# Altium project PCB_Project.PrjPcb
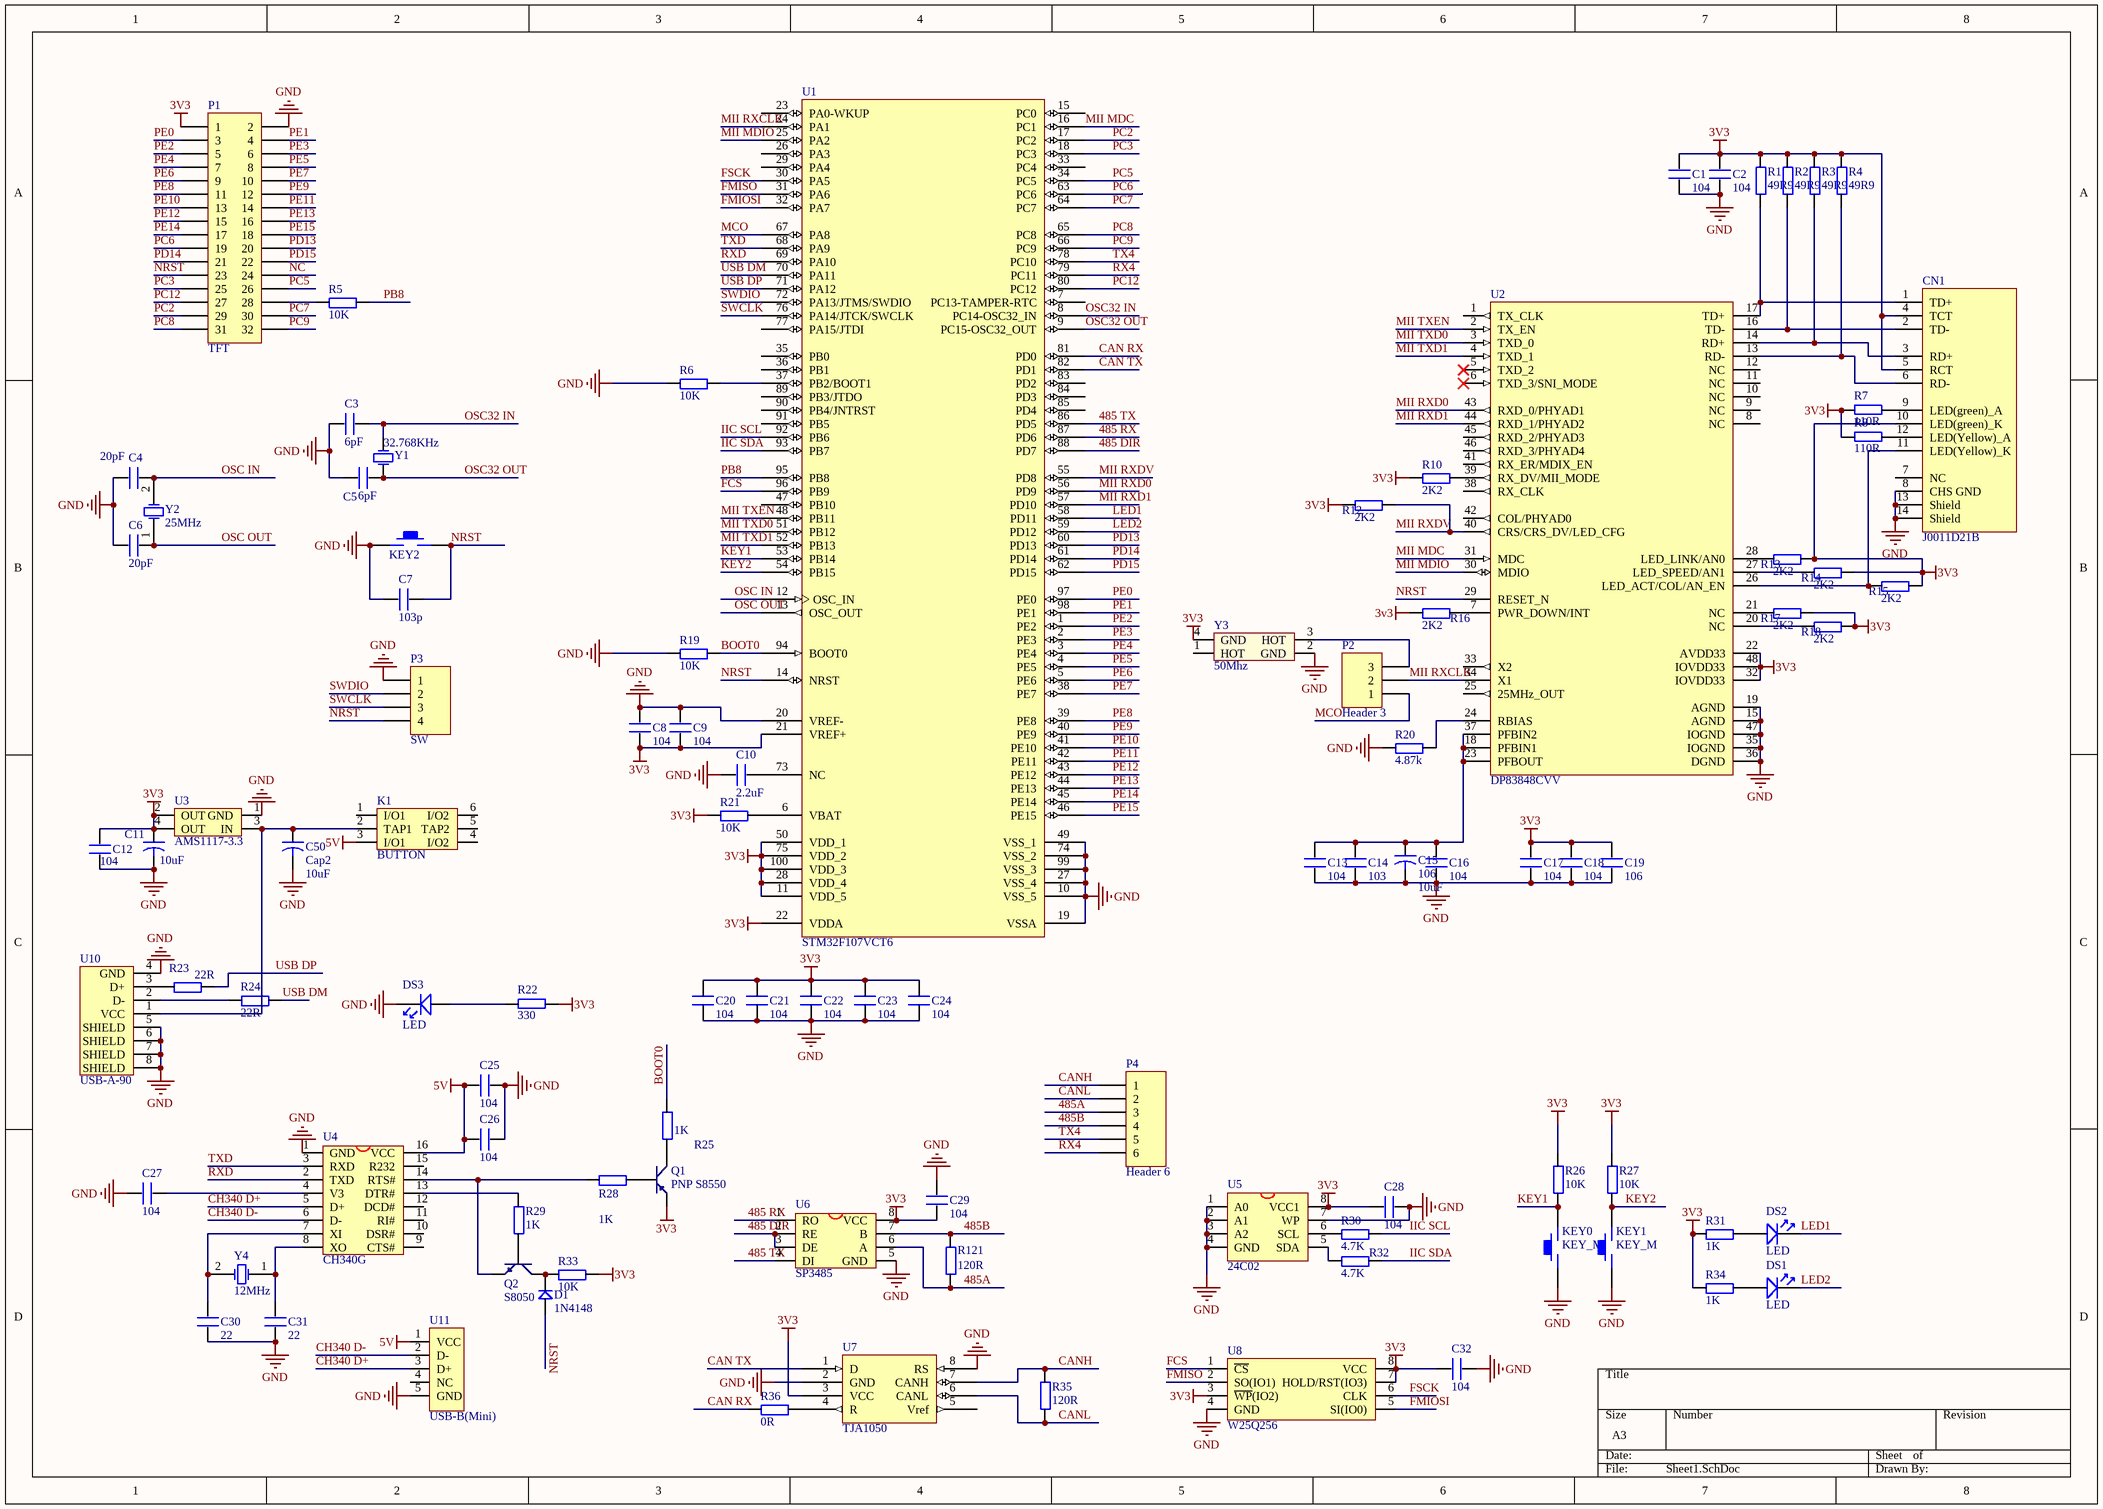
[diagram p0: Sheet1.SchDoc]
1 sheet, 97 parts. Net scope: global (net labels, ports and power ports of the same name join across sheets).
Board file: PCB1.PcbDoc

## Sheet Sheet1.SchDoc
size A3

### Parts
C1  104  [0603C]
C2  104  [0603C]
C3  6pF  [0603C]
C4  20pF  [0603C]
C5  6pF  [0603C]
C6  20pF  [0603C]
C7  103p  [0603C]
C8  104  [0603C]
C9  104  [0603C]
C10  2.2uF  [0603C]
C11  10uF  [1206C]
C12  104  [0603C]
C13  104  [0603C]
C14  103  [0603C]
C15  106  value 10uF  [1206C]
C16  104  [0603C]
C17  104  [0603C]
C18  104  [0603C]
C19  106  [0603C]
C20  104  [0603C]
C21  104  [0603C]
C22  104  [0603C]
C23  104  [0603C]
C24  104  [0603C]
C25  104  [0603C]
C26  104  [0603C]
C27  104  [0603C]
C28  104  [0603C]
C29  104  [0603C]
C30  22  [0603C]
C31  22  [0603C]
C32  104  [0603C]
C50  Cap2  value 10uF  [1206C]
CN1  J0011D21B  [RJ45-12]
D1  1N4148  [DIODE_SOP]
DS1  LED  [SMDLED-0603]
DS2  LED  [SMDLED-0603]
DS3  LED  [SMDLED-0603]
K1  BUTTON  [BTN8.5*8.5]
KEY0  KEY_M  [KEY_SOP3625]
KEY1  KEY_M  [KEY_SOP3625]
KEY2  KEY_M  [KEY_SOP3625]  (value not drawn)
P1  TFT  [HDR2X16]
P2  Header 3  [HDR1X3]
P3  SW  [HDR1X4]
P4  Header 6  [HDR1X6]
Q1  PNP S8550  [SOT-23R]
Q2  S8050  [SOT-23R]
R1  49R9  [0603R]
R2  49R9  [0603R]
R3  49R9  [0603R]
R4  49R9  [0603R]
R5  10K  [0603R]
R6  10K  [0603R]
R7  110R  [0603R]
R8  110R  [0603R]
R10  2K2  [0603R]
R12  2K2  [0603R]
R13  2K2  [0603R]
R14  2K2  [0603R]
R15  2K2  [0603R]
R16  2K2  [0603R]
R17  2K2  [0603R]
R18  2K2  [0603R]
R19  10K  [0603R]
R20  4.87k  [0603R]
R21  10K  [0603R]
R22  330  [0603R]
R23  22R  [0603R]
R24  22R  [0603R]
R25  1K  [0603R]
R26  10K  [0603R]
R27  10K  [0603R]
R28  1K  [0603R]
R29  1K  [0603R]
R30  4.7K  [0603R]
R31  1K  [0603R]
R32  4.7K  [0603R]
R33  10K  [0603R]
R34  1K  [0603R]
R35  120R  [0603R]
R36  0R  [0603R]
R121  120R  [0603R]
U1  STM32F107VCT6  [LQFP100_N]
U2  DP83848CVV  [LQFP48]
U3  AMS1117-3.3  [AMS1117]
U4  CH340G  [SOP16M]
U5  24C02  [SOP-8]
U6  SP3485  [SOP-8]
U7  TJA1050  [SOP-8]
U8  W25Q256  [LC-SOP-8_208mil]
U10  USB-A-90  [USB_2]
U11  USB-B(Mini)  [USB_AB]
Y1  32.768KHz  [XTAL3215]
Y2  25MHz  [XTAL_US]
Y3  50Mhz  [XTAL3225]
Y4  12MHz  [XTAL_US]

### Nets
3V3: C1.2 C2.2 C8.1 C9.1 C11.1 C12.2 C17.2 C18.2 C19.2 C20.2 C21.2 C22.2 C23.2 C24.2 C28.1 C29.1 C32.1 CN1.4(TCT) CN1.5(RCT) CN1.10(LED(green)_K) P1.1 Q1.1(E) R1.2 R2.2 R3.2 R4.2 R7.2 R8.2 R10.1 R12.1 R13.2 R14.2 R15.2 R16.1 R17.2 R18.2 R21.1 R22.1 R26.2 R27.2 R31.1 R33.2 R34.1 U1.11(VDD_5) U1.21(VREF+) U1.22(VDDA) U1.28(VDD_4) U1.50(VDD_1) U1.75(VDD_2) U1.100(VDD_3) U2.22(AVDD33) U2.32(IOVDD33) U2.48(IOVDD33) U3.2(OUT) U3.4(OUT) U5.8(VCC1) U6.8(VCC) U7.3(VCC) U8.3(~{WP}(IO2)) U8.7(HOLD/RST(IO3)) U8.8(VCC) Y3.4(GND)
5V: C25.1 C26.1 K1.3(I/O1) U4.16(VCC) U11.1(VCC)
GND: C1.1 C2.1 C3.2 C4.1 C5.2 C6.1 C7.1 C8.2 C9.2 C10.1 C11.2 C12.1 C13.1 C14.1 C15.2 C16.1 C17.1 C18.1 C19.1 C20.1 C21.1 C22.1 C23.1 C24.1 C25.2 C26.2 C27.1 C28.2 C29.2 C30.1 C31.2 C32.2 C50.2 CN1.8(CHS_GND) CN1.13(Shield) CN1.14(Shield) DS3.2 KEY0.1 KEY1.1 KEY2.1 P1.2 P3.1 R6.1 R19.1 R20.1 U1.10(VSS_5) U1.19(VSSA) U1.20(VREF-) U1.27(VSS_4) U1.49(VSS_1) U1.74(VSS_2) U1.99(VSS_3) U2.15(AGND) U2.19(AGND) U2.35(IOGND) U2.36(DGND) U2.47(IOGND) U3.1(GND) U4.1(GND) U5.1(A0) U5.2(A1) U5.3(A2) U5.4(GND) U5.7(WP) U6.5(GND) U7.2(GND) U7.8(RS) U8.4(GND) U10.4(GND) U10.5(SHIELD) U10.6(SHIELD) U10.7(SHIELD) U10.8(SHIELD) U11.5(GND) Y3.2(GND)
485 DIR: U1.88(PD7) U6.2(RE) U6.3(DE)
485 RX: U1.87(PD6) U6.1(RO)
485 TX: U1.86(PD5) U6.4(DI)
485A: P4.3 R121.1 U6.6(A)
485B: P4.4 R121.2 U6.7(B)
BOOT0: R19.2 R25.2 U1.94(BOOT0)
CAN RX: R36.1 U1.81(PD0)
CAN TX: U1.82(PD1) U7.1(D)
CANH: P4.1 R35.2 U7.7(CANH)
CANL: P4.2 R35.1 U7.6(CANL)
CH340 D+: U4.5(D+) U11.3(D+)
CH340 D-: U4.6(D-) U11.2(D-)
FCS: U1.96(PB9) U8.1(~{CS})
FMIOSI: U1.32(PA7) U8.5(SI(IO0))
FMISO: U1.31(PA6) U8.2(SO(IO1))
FSCK: U1.30(PA5) U8.6(CLK)
IIC SCL: R30.2 U1.92(PB6)
IIC SDA: R32.2 U1.93(PB7)
KEY1: KEY0.2 R26.1 U1.53(PB14)
KEY2: KEY1.2 R27.1 U1.54(PB15)
LED1: DS2.2 U1.58(PD11)
LED2: DS1.2 U1.59(PD12)
MCO: P2.1 U1.67(PA8)
MII MDC: U1.16(PC1) U2.31(MDC)
MII MDIO: U1.25(PA2) U2.30(MDIO)
MII RXCLK: P2.2 U1.24(PA1) U2.34(X1)
MII RXD0: U1.56(PD9) U2.43(RXD_0/PHYAD1)
MII RXD1: U1.57(PD10) U2.44(RXD_1/PHYAD2)
MII RXDV: R12.2 U1.55(PD8) U2.40(CRS/CRS_DV/LED_CFG)
MII TXD0: U1.51(PB12) U2.3(TXD_0)
MII TXD1: U1.52(PB13) U2.4(TXD_1)
MII TXEN: U1.48(PB11) U2.2(TX_EN)
NC: P1.24
NRST: C7.2 D1.1 KEY2.2 P1.23 P3.4 U1.14(NRST) U2.29(RESET_N)
OSC32 IN: C3.1 U1.8(PC14-OSC32_IN) Y1.1(OSC1)
OSC32 OUT: C5.1 U1.9(PC15-OSC32_OUT) Y1.2(OSC2)
OSC IN: C4.2 U1.12(OSC_IN) Y2.2(OSC2)
OSC OUT: C6.2 U1.13(OSC_OUT) Y2.1(OSC1)
PB8: R5.2 U1.95(PB8)
PC2: P1.29 U1.17(PC2)
PC3: P1.25 U1.18(PC3)
PC5: P1.26 U1.34(PC5)
PC6: P1.19 U1.63(PC6)
PC7: P1.30 U1.64(PC7)
PC8: P1.31 U1.65(PC8)
PC9: P1.32 U1.66(PC9)
PC12: P1.27 U1.80(PC12)
PD13: P1.20 U1.60(PD13)
PD14: P1.21 U1.61(PD14)
PD15: P1.22 U1.62(PD15)
PE0: P1.3 U1.97(PE0)
PE1: P1.4 U1.98(PE1)
PE2: P1.5 U1.1(PE2)
PE3: P1.6 U1.2(PE3)
PE4: P1.7 U1.3(PE4)
PE5: P1.8 U1.4(PE5)
PE6: P1.9 U1.5(PE6)
PE7: P1.10 U1.38(PE7)
PE8: P1.11 U1.39(PE8)
PE9: P1.12 U1.40(PE9)
PE10: P1.13 U1.41(PE10)
PE11: P1.14 U1.42(PE11)
PE12: P1.15 U1.43(PE12)
PE13: P1.16 U1.44(PE13)
PE14: P1.17 U1.45(PE14)
PE15: P1.18 U1.46(PE15)
RX4: P4.6 U1.79(PC11)
RXD: U1.69(PA10) U4.2(TXD)
SWCLK: P3.3 U1.76(PA14/JTCK/SWCLK)
SWDIO: P3.2 U1.72(PA13/JTMS/SWDIO)
TX4: P4.5 U1.78(PC10)
TXD: U1.68(PA9) U4.3(RXD)
USB DM: R24.2 U1.70(PA11)
USB DP: R23.2 U1.71(PA12)
NetC10_2: C10.2 U1.73(NC)
NetC13_2: C13.2 C14.2 C15.1 C16.2 U2.18(PFBIN1) U2.23(PFBOUT) U2.37(PFBIN2)
NetC27_2: C27.2 U4.4(V3)
NetC30_2: C30.2 U4.7(XI) Y4.2(OSC2)
NetC31_1: C31.1 U4.8(XO) Y4.1(OSC1)
NetC50_1: C50.1 K1.2(TAP1) U3.3(IN) U10.1(VCC)
NetCN1_1: CN1.1(TD+) R1.1 U2.17(TD+)
NetCN1_2: CN1.2(TD-) R2.1 U2.16(TD-)
NetCN1_3: CN1.3(RD+) R3.1 U2.14(RD+)
NetCN1_6: CN1.6(RD-) R4.1 U2.13(RD-)
NetCN1_9: CN1.9(LED(green)_A) R7.1
NetCN1_11: CN1.11(LED(Yellow)_K) R15.1 U2.26(LED_ACT/COL/AN_EN)
NetCN1_12: CN1.12(LED(Yellow)_A) R8.1
NetD1_2: D1.2 Q2.3(C) R33.1
NetDS1_1: DS1.1 R34.2
NetDS2_1: DS2.1 R31.2
NetDS3_1: DS3.1 R22.2
NetP1_28: P1.28 R5.1
NetP2_3: P2.3 Y3.3(HOT)
NetQ1_2: Q1.2(B) R28.2
NetQ1_3: Q1.3(C) R25.1
NetQ2_1: Q2.1(E) R28.1 U4.14(RTS#)
NetQ2_2: Q2.2(B) R29.1
NetR6_2: R6.2 U1.37(PB2/BOOT1)
NetR10_2: R10.2 U2.39(RX_DV/MII_MODE)
NetR13_1: R13.1 U2.28(LED_LINK/AN0)
NetR14_1: R14.1 U2.27(LED_SPEED/AN1)
NetR16_2: R16.2 U2.7(PWR_DOWN/INT)
NetR17_1: R17.1 U2.21(NC)
NetR18_1: R18.1 U2.20(NC)
NetR20_2: R20.2 U2.24(RBIAS)
NetR21_2: R21.2 U1.6(VBAT)
NetR23_1: R23.1 U10.3(D+)
NetR24_1: R24.1 U10.2(D-)
NetR29_2: R29.2 U4.13(DTR#)
NetR30_1: R30.1 U5.6(SCL)
NetR32_1: R32.1 U5.5(SDA)
NetR36_2: R36.2 U7.4(R)

Not connected (* = marked no-connect by the designer): CN1 7(NC); K1 1(I/O1) 4(I/O2) 5(TAP2) 6(I/O2); U1 7(PC13-TAMPER-RTC) 15(PC0) 23(PA0-WKUP) 26(PA3) 29(PA4) 33(PC4) 35(PB0) 36(PB1) 47(PB10) 77(PA15/JTDI) 83(PD2) 84(PD3) 85(PD4) 89(PB3/JTDO) 90(PB4/JNTRST) 91(PB5); U2 1(TX_CLK) 5(TXD_2)* 6(TXD_3/SNI_MODE)* 8(NC) 9(NC) 10(NC) 11(NC) 12(NC) 25(25MHz_OUT) 33(X2) 38(RX_CLK) 41(RX_ER/MDIX_EN) 42(COL/PHYAD0) 45(RXD_2/PHYAD3) 46(RXD_3/PHYAD4); U4 9(CTS#) 10(DSR#) 11(RI#) 12(DCD#) 15(R232); U7 5(Vref); U11 4(NC); Y3 1(HOT)

### Library data of the parts
C1-C10 C12-C14 C16-C32 = C
C11 C15 C50 = Cap2: Capacitor; Published: 23-Sep-2002; PackageReference: CAPR5-4X5; Publisher: Altium Limited; PackageDescription: Capacitor; 2 Leads
D1 = D
P1 = Header 16X2: Header, 16-Pin, Dual row; LatestRevisionDate: 17-Jul-2002; LatestRevisionNote: Re-released for DXP Platform.; Publisher: Altium Limited
P2 = Header 3: Header, 3-Pin; LatestRevisionDate: 17-Jul-2002; LatestRevisionNote: Re-released for DXP Platform.; Publisher: Altium Limited
P3 = Header 4: Header, 4-Pin; LatestRevisionDate: 17-Jul-2002; LatestRevisionNote: Re-released for DXP Platform.; Publisher: Altium Limited
P4 = Header 6: Header, 6-Pin; LatestRevisionDate: 17-Jul-2002; LatestRevisionNote: Re-released for DXP Platform.; Publisher: Altium Limited
Q1 = PNP: 8550/BCW68
Q2 = NPN: 8050/BCW846/BCW847
R1-R8 R10 R12-R36 R121 = R
U1 = STM32F103VBT6: STM32 ARM-based 32-bit MCU with 64 Kbytes Flash, 100-pin LQFP, Industrial Temperature; Published: 30-May-2008; DatasheetVersion: rev6, Mar-2008; PackageVersion: Mar-2008; PackageReference: LQFP100; Publisher: Altium Limited; PackageDescription: 100-Pin Low-Profile Quad Flat Pack, 14 x 14 mm Body, 0.5 mm Pitch (LQFP100); ComponentLink1Description: Manufacturer Link; ComponentLink1URL: www.st.com/stm32; ComponentLink2Description: Datasheet; ComponentLink2URL: http://www.st.com/stonline/products/literature/ds/13587.pdf
U3 = AMS1117
U4 = CH340G: USB2UART
U5 = 24C256: EEPROM
U6 = MAX3485
U7 = SN65HVD230D
U8 = W25Q128
U10 = USB_A_90
U11 = USB5
Y1 = XTAL: 普通晶振; Published: 8-Jun-2000; LatestRevisionDate: 17-Jul-2002; LatestRevisionNote: Re-released for DXP Platform.; Publisher: Altium Limited
Y2 Y4 = XTAL: Crystal Oscillator; Published: 8-Jun-2000; LatestRevisionDate: 17-Jul-2002; LatestRevisionNote: Re-released for DXP Platform.; Publisher: Altium Limited
Y3 = XTAL_3225: 3225贴片无源晶振